# Altium schematic sheet lpf.SchDoc
size A4; SheetNumber: 2; SheetTotal: 5
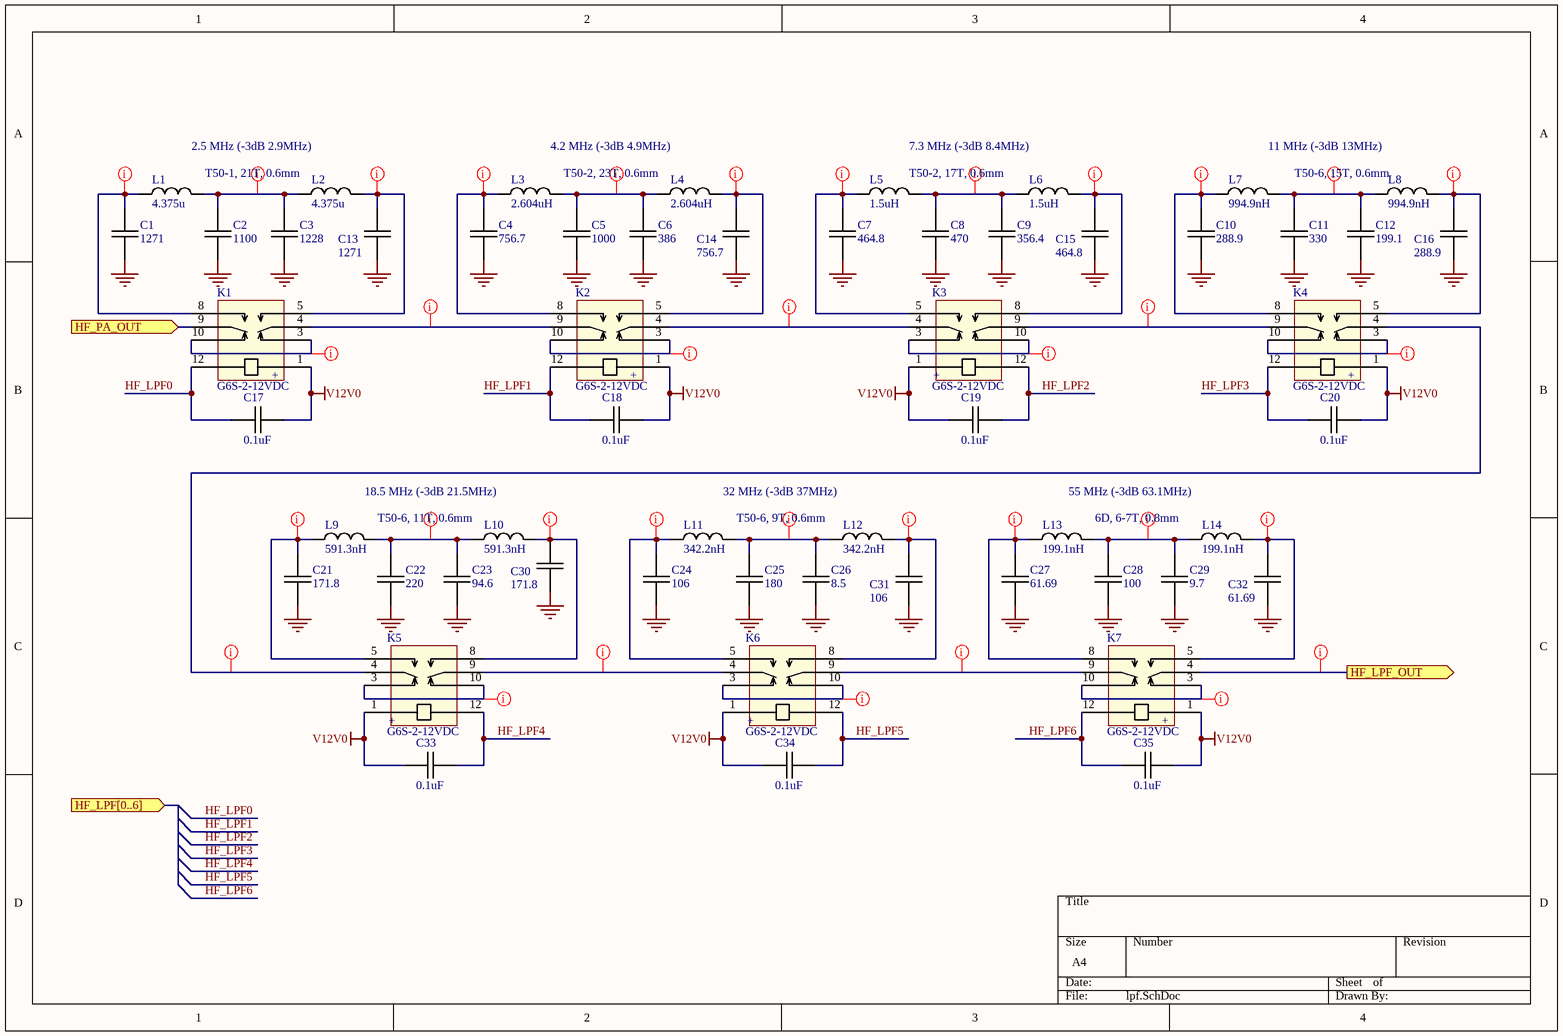
[diagram p0: lpf.SchDoc]

## Parts
C1  1271  [CAPC3216X125N]
C2  1100  [CAPC3216X125N]
C3  1228  [CAPC3216X125N]
C4  756.7  [CAPC3216X125N]
C5  1000  [CAPC3216X125N]
C6  386  [CAPC3216X125N]
C7  464.8  [CAPC3216X125N]
C8  470  [CAPC3216X125N]
C9  356.4  [CAPC3216X125N]
C10  288.9  [CAPC3216X125N]
C11  330  [CAPC3216X125N]
C12  199.1  [CAPC3216X125N]
C13  1271  [CAPC3216X125N]
C14  756.7  [CAPC3216X125N]
C15  464.8  [CAPC3216X125N]
C16  288.9  [CAPC3216X125N]
C17  0.1uF  [CAPC2013X100N]
C18  0.1uF  [CAPC2013X100N]
C19  0.1uF  [CAPC2013X100N]
C20  0.1uF  [CAPC2013X100N]
C21  171.8  [CAPC3216X125N]
C22  220  [CAPC3216X125N]
C23  94.6  [CAPC3216X125N]
C24  106  [CAPC3216X125N]
C25  180  [CAPC3216X125N]
C26  8.5  [CAPC3216X125N]
C27  61.69  [CAPC3216X125N]
C28  100  [CAPC3216X125N]
C29  9.7  [CAPC3216X125N]
C30  171.8  [CAPC3216X125N]
C31  106  [CAPC3216X125N]
C32  61.69  [CAPC3216X125N]
C33  0.1uF  [CAPC2013X100N]
C34  0.1uF  [CAPC2013X100N]
C35  0.1uF  [CAPC2013X100N]
K1  G6S-2-12VDC  [G6S-2]
K2  G6S-2-12VDC  [G6S-2]
K3  G6S-2-12VDC  [G6S-2]
K4  G6S-2-12VDC  [G6S-2]
K5  G6S-2-12VDC  [G6S-2]
K6  G6S-2-12VDC  [G6S-2]
K7  G6S-2-12VDC  [G6S-2]
L1  4.375u  [T50-2]
L2  4.375u  [T50-2]
L3  2.604uH  [T50-2]
L4  2.604uH  [T50-2]
L5  1.5uH  [T50-6]
L6  1.5uH  [T50-6]
L7  994.9nH  [T50-6]
L8  994.9nH  [T50-6]
L9  591.3nH  [T50-6]
L10  591.3nH  [T50-6]
L11  342.2nH  [T50-6]
L12  342.2nH  [T50-6]
L13  199.1nH  [T50-6]
L14  199.1nH  [T50-6]

## Ports
HF_LPF[0..6] (in), HF_LPF_OUT (out), HF_PA_OUT (in)

## Nets
GND: C1.1 C2.1 C3.1 C4.1 C5.1 C6.1 C7.1 C8.1 C9.1 C10.1 C11.1 C12.1 C13.1 C14.1 C15.1 C16.1 C21.1 C22.1 C23.1 C24.1 C25.1 C26.1 C27.1 C28.1 C29.1 C30.1 C31.1 C32.1
V12V0: C17.1 C18.1 C19.2 C20.1 C33.2 C34.2 C35.1 K1.1 K2.1 K3.1 K4.1 K5.1 K6.1 K7.1
HF_LPF0: C17.2 K1.12
HF_LPF1: C18.2 K2.12
HF_LPF2: C19.1 K3.12
HF_LPF3: C20.2 K4.12
HF_LPF4: C33.1 K5.12
HF_LPF5: C34.1 K6.12
HF_LPF6: C35.2 K7.12
HF_LPF_OUT: K7.4 ; port HF_LPF_OUT
HF_PA_OUT: K1.9 ; port HF_PA_OUT
NetC1_2: C1.2 K1.8 L1.1
NetC2_2: C2.2 C3.2 L1.2 L2.1
NetC4_2: C4.2 K2.8 L3.1
NetC5_2: C5.2 C6.2 L3.2 L4.1
NetC7_2: C7.2 K3.5 L5.1
NetC8_2: C8.2 C9.2 L5.2 L6.1
NetC10_2: C10.2 K4.8 L7.1
NetC11_2: C11.2 C12.2 L7.2 L8.1
NetC13_2: C13.2 K1.5 L2.2
NetC14_2: C14.2 K2.5 L4.2
NetC15_2: C15.2 K3.8 L6.2
NetC16_2: C16.2 K4.5 L8.2
NetC21_2: C21.2 K5.5 L9.1
NetC22_2: C22.2 C23.2 L9.2 L10.1
NetC24_2: C24.2 K6.5 L11.1
NetC25_2: C25.2 C26.2 L11.2 L12.1
NetC27_2: C27.2 K7.8 L13.1
NetC28_2: C28.2 C29.2 L13.2 L14.1
NetC30_2: C30.2 K5.8 L10.2
NetC31_2: C31.2 K6.8 L12.2
NetC32_2: C32.2 K7.5 L14.2
NetK1_3: K1.3 K1.10
NetK1_4: K1.4 K2.9
NetK2_3: K2.3 K2.10
NetK2_4: K2.4 K3.4
NetK3_3: K3.3 K3.10
NetK3_9: K3.9 K4.9
NetK4_3: K4.3 K4.10
NetK4_4: K4.4 K5.4
NetK5_3: K5.3 K5.10
NetK5_9: K5.9 K6.4
NetK6_3: K6.3 K6.10
NetK6_9: K6.9 K7.9
NetK7_3: K7.3 K7.10

## Layout directives
net class OutPowerNet: HF_LPF_OUT, NetC1_2, NetC2_2, NetC4_2, NetC5_2, NetC7_2, NetC8_2, NetC10_2, NetC11_2, NetC13_2, NetC14_2, NetC15_2, NetC16_2, NetC21_2, NetC22_2, NetC24_2, NetC25_2, NetC27_2, NetC28_2, NetC30_2, NetC31_2, NetC32_2, NetK1_3, NetK1_4, NetK2_3, NetK2_4, NetK3_3, NetK3_9, NetK4_3, NetK4_4, NetK5_3, NetK5_9, NetK6_3, NetK6_9, NetK7_3

## Notes on the sheet
- 2.5 MHz (-3dB 2.9MHz)
- T50-1, 21T, 0.6mm
- 4.2 MHz (-3dB 4.9MHz)
- T50-2, 23T, 0.6mm
- 7.3 MHz (-3dB 8.4MHz)
- T50-2, 17T, 0.6mm
- 11 MHz (-3dB 13MHz)
- (near L8) T50-6, 15T, 0.6mm
- 18.5 MHz (-3dB 21.5MHz)
- 32 MHz (-3dB 37MHz)
- 55 MHz (-3dB 63.1MHz)
- T50-6, 11T, 0.6mm
- T50-6, 9T, 0.6mm
- 6D, 6-7T, 0.8mm
- (in symbol G6S-2-12VDC) +

## Library data of the parts
C1-C16 C21-C32 = Cap1206: 1206, NP0, 1kV
C17-C20 C33-C35 = Cap0805: Capacitor 2x1.25 mm
K1-K7 = G6S-2-12VDC: Compact, Industry-Standard 2-pole relay
L1 L2 = Inductor: T50-1
L3-L6 = Inductor: T50-2
L7-L14 = Inductor: T50-6